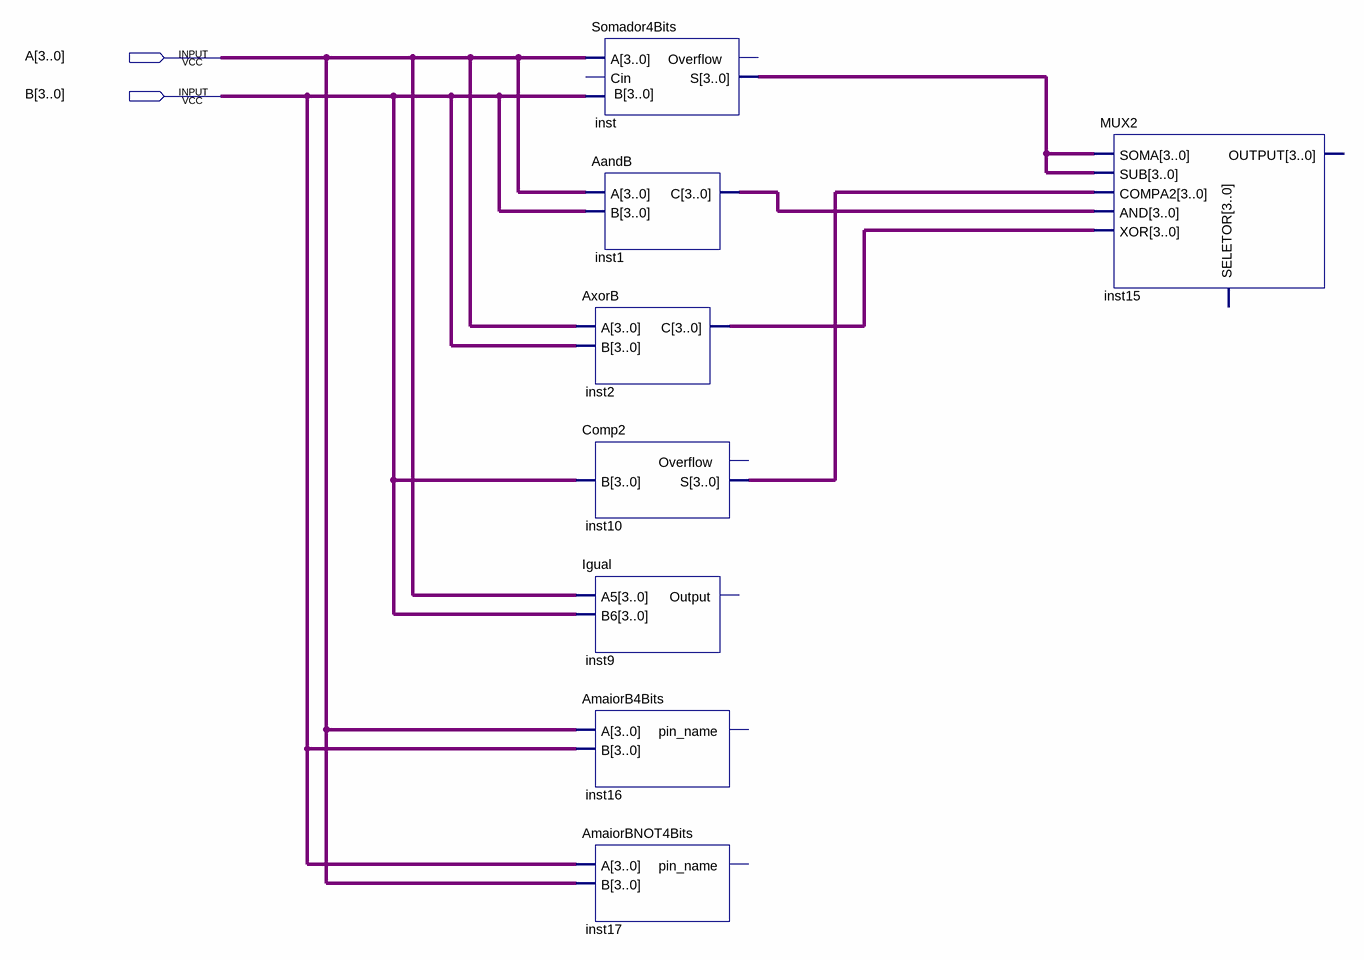
[diagram p0: schematic sheet]
// Quartus schematic MUX.bdf as structural Verilog: 8 symbols, 2 pins
module MUX (
  input  [3:0] A,
  input  [3:0] B
);

  wire [3:0] inst1_c, inst2_c, inst10_s, inst_s;

  Somador4Bits inst (.A(A), .B(B), .S(inst_s));  // open: Cin, Overflow
  AandB inst1 (.A(A), .B(B), .C(inst1_c));
  AxorB inst2 (.A(A), .B(B), .C(inst2_c));
  Comp2 inst10 (.B(B), .S(inst10_s));  // open: Overflow
  Igual inst9 (.A5(A), .B6(B));  // open: Output
  AmaiorB4Bits inst16 (.A(A), .B(B));  // open: pin_name
  AmaiorBNOT4Bits inst17 (.A(B), .B(A));  // open: pin_name
  MUX2 inst15 (.SOMA(inst_s), .SUB(inst_s), .COMPA2(inst10_s), .AND(inst1_c), .XOR(inst2_c));  // open: SELETOR, OUTPUT
endmodule
